# Altium project MotorControlBoard_A4988.PrjPcb
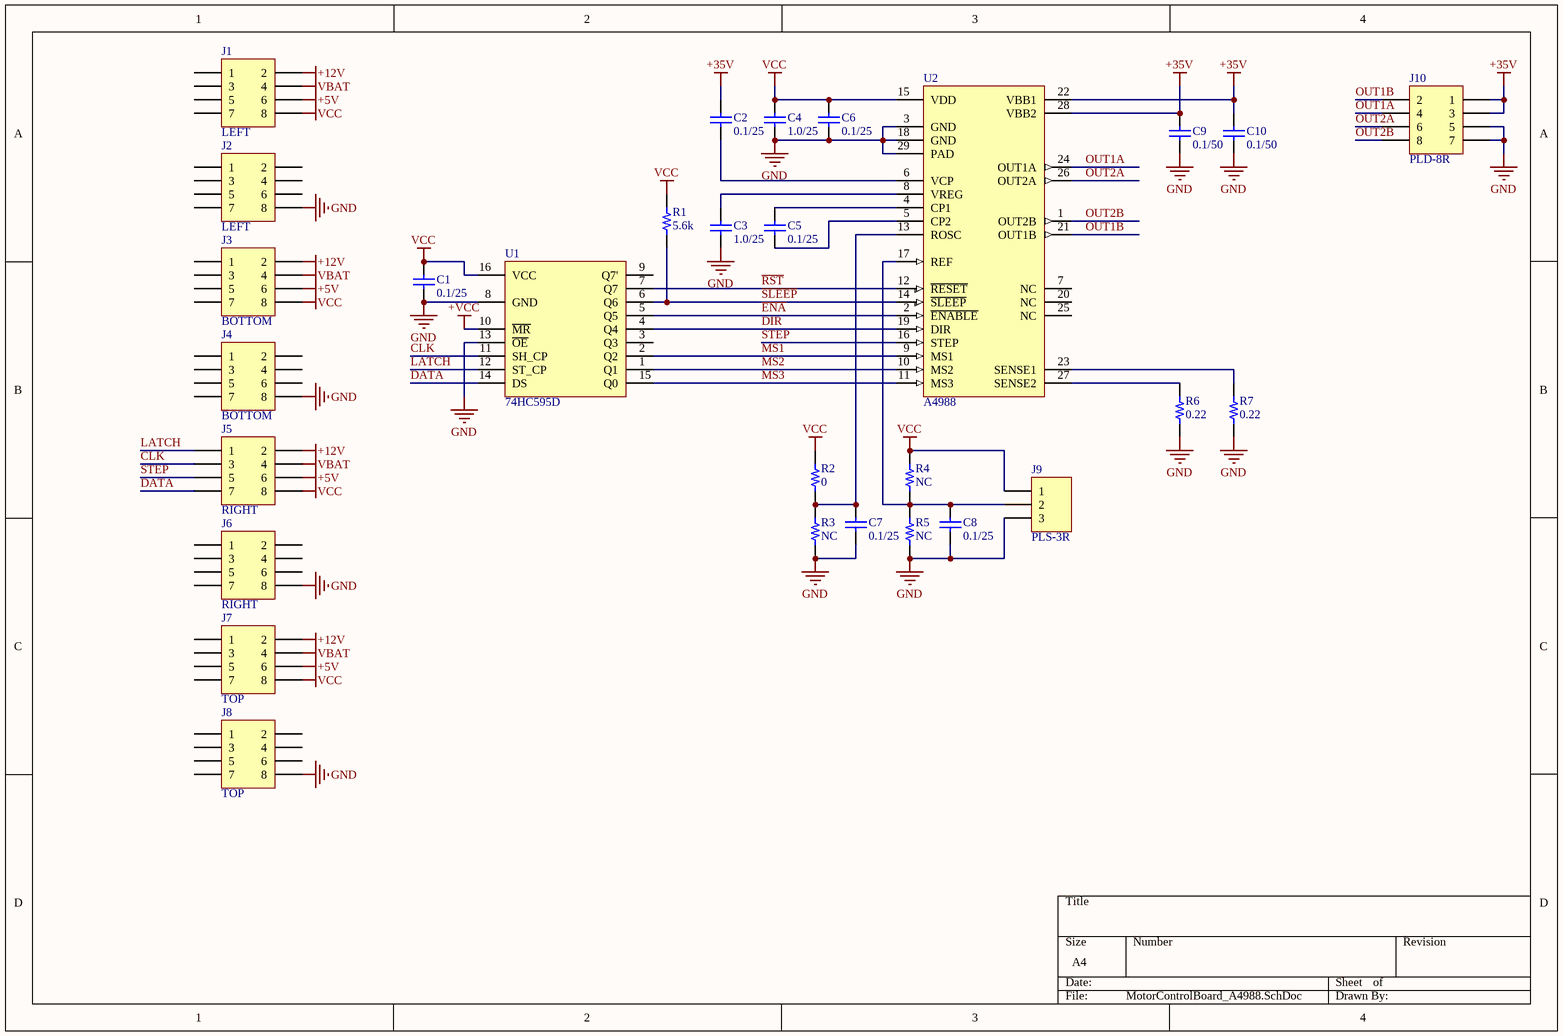
[diagram p0: MotorControlBoard_A4988.SchDoc]
1 sheet, 29 parts. Net scope: global (net labels, ports and power ports of the same name join across sheets).
Board file: MotorControlBoard_A4988.PcbDoc

## Sheet MotorControlBoard_A4988.SchDoc
size A4

### Parts
C1  0.1/25  [CAP0603]
C2  0.1/25  [CAP0402]
C3  1.0/25  [CAP0402]
C4  1.0/25  [CAP0402]
C5  0.1/25  [CAP0402]
C6  0.1/25  [CAP0402]
C7  0.1/25  [CAP0402]
C8  0.1/25  [CAP0402]
C9  0.1/50  [CAP0805]
C10  0.1/50  [CAP0805]
J1  LEFT  [PBDM-8]
J2  LEFT  [PBDM-8]
J3  BOTTOM  [PBDM-8]
J4  BOTTOM  [PBDM-8]
J5  RIGHT  [PBDM-8]
J6  RIGHT  [PBDM-8]
J7  TOP  [PBDM-8]
J8  TOP  [PBDM-8]
J9  PLS-3R  [PLS-3R]
J10  PLD-8R  [PLD-8R]
R1  5.6k  [RES0402]
R2  0  [RES0402]
R3  NC  [RES0402]
R4  NC  [RES0402]
R5  NC  [RES0402]
R6  0.22  [RES2512]
R7  0.22  [RES2512]
U1  74HC595D  [SO16]
U2  A4988  [QFN28-0.5]

### Nets
+5V: J1.6 J3.6 J5.6 J7.6
+12V: J1.2 J3.2 J5.2 J7.2
+35V: C2.2 C9.2 C10.2 J10.1 J10.3 U2.22(VBB1) U2.28(VBB2)
+VCC: U1.10(~{MR})
GND: C1.1 C3.1 C4.1 C6.1 C7.1 C8.1 C9.1 C10.1 J2.8 J4.8 J6.8 J8.8 J9.3 J10.5 J10.7 R3.2 R5.2 R6.1 R7.1 U1.8(GND) U1.13(~{OE}) U2.3(GND) U2.18(GND) U2.29(PAD)
VBAT: J1.4 J3.4 J5.4 J7.4
VCC: C1.2 C4.2 C6.2 J1.8 J3.8 J5.8 J7.8 J9.1 R1.1 R2.1 R4.1 U1.16(VCC) U2.15(VDD)
CLK: J5.3 U1.11(SH_CP)
DATA: J5.7 U1.14(DS)
DIR: U1.4(Q4) U2.19(DIR)
~{ENA}: U1.5(Q5) U2.2(~{ENABLE})
LATCH: J5.1 U1.12(ST_CP)
MS1: U1.2(Q2) U2.9(MS1)
MS2: U1.1(Q1) U2.10(MS2)
MS3: U1.15(Q0) U2.11(MS3)
OUT1A: J10.4 U2.24(OUT1A)
OUT1B: J10.2 U2.21(OUT1B)
OUT2A: J10.6 U2.26(OUT2A)
OUT2B: J10.8 U2.1(OUT2B)
~{RST}: U1.7(Q7) U2.12(~{RESET})
~{SLEEP}: R1.2 U1.6(Q6) U2.14(~{SLEEP})
STEP: J5.5 U2.16(STEP)
NetC2_1: C2.1 U2.6(VCP)
NetC3_2: C3.2 U2.8(VREG)
NetC5_1: C5.1 U2.5(CP2)
NetC5_2: C5.2 U2.4(CP1)
NetC7_2: C7.2 R2.2 R3.1 U2.13(ROSC)
NetC8_2: C8.2 J9.2 R4.2 R5.1 U2.17(REF)
NetR6_2: R6.2 U2.27(SENSE2)
NetR7_2: R7.2 U2.23(SENSE1)

Not connected (* = marked no-connect by the designer): J1 1 3 5 7; J2 1 2 3 4 5 6 7; J3 1 3 5 7; J4 1 2 3 4 5 6 7; J6 1 2 3 4 5 6 7; J7 1 3 5 7; J8 1 2 3 4 5 6 7; U1 3(Q3) 9(Q7'); U2 7(NC) 20(NC) 25(NC)

### Library data of the parts
C1 = CAP0603: Ceramic chip capacitor 0603; Value: 0.1; Voltage: 25; PartNumber: CAP0603; Category: Capacitor; Author: oiezhov
C2 C5-C8 = CAP0402: Ceramic chip capacitor 0402; Value: 0.1; Voltage: 25; PartNumber: CAP0402; Category: Capacitor; Author: oiezhov
C3 C4 = CAP0402: Ceramic chip capacitor 0402; Value: 1.0; Voltage: 25; PartNumber: CAP0402; Category: Capacitor; Author: oiezhov
C9 C10 = CAP0805: Ceramic chip capacitor 0805; Value: 0.1; Voltage: 50; PartNumber: CAP0805; Category: Capacitor; Author: oiezhov
J1-J8 = PBDM-8: 2x4-pin header, pitch 2.54 mm; PartNumber: PBDM-8; Category: Connector; ComponentLink1Description: Datasheet; ComponentLink1URL: d:\_AltiumLibs\Pdf\Mechanical\Connector\pbsm.pdf; Author: oiezhov
J9 = PLS-3R: 3-pin angle header, pitch 2.54 mm; PartNumber: PLS-3R; Category: Connector; ComponentLink1Description: Datasheet; ComponentLink1URL: d:\_AltiumLibs\Pdf\Mechanical\Connector\PLS, PLD.pdf; Author: oiezhov
J10 = PLD-8R: 2x4-pin angle header, pitch 2.54 mm; PartNumber: PLD-8R; Category: Connector; ComponentLink1Description: Datasheet; ComponentLink1URL: d:\_AltiumLibs\Pdf\Mechanical\Connector\PLS, PLD.pdf; Author: oiezhov
R1-R5 = RES0402: Ceramic chip resistor; PartNumber: RES0402; Category: Resistor; Author: oiezhov
  R1: Value: 5.6k
  R2: Value: 0
  R3-R5: Value: NC
R6 R7 = RES2512: Ceramic chip resistor; PartNumber: RES2512; Value: 0.22; Category: Resistor; Author: oiezhov
U1 = 74HC595D: 8-bit serial-in, serial or parallel-out shift register with output latches; 3-state; PartNumber: 74HC595D; Category: IC/Logic; ComponentLink1Description: Datasheet; ComponentLink1URL: d:\_AltiumLibs\Pdf\IC\Logic\74HC_HCT595.pdf; Author: oiezhov
U2 = A4988: DMOS Microstepping Driver with Translator And Overcurrent Protection; PartNumber: A4988; Category: IC/Motor Driver; ComponentLink1Description: Datasheet; ComponentLink1URL: d:\_AltiumLibs\Pdf\IC\MotorDriver\A4988.pdf; Author: oiezhov